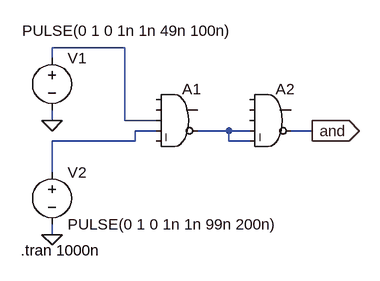
[diagram p0: schematic and_using_NAND.asc]
and_using_NAND.asc, the LTspice schematic file:
Version 4
SHEET 1 880 680
WIRE 128 16 16 16
WIRE 16 32 16 16
WIRE 16 128 16 112
WIRE 128 128 128 16
WIRE 176 128 128 128
WIRE 176 144 144 144
WIRE 288 144 240 144
WIRE 320 144 288 144
WIRE 416 144 384 144
WIRE 144 160 144 144
WIRE 144 160 16 160
WIRE 288 160 288 144
WIRE 320 160 288 160
WIRE 16 208 16 160
WIRE 16 304 16 288
FLAG 16 128 0
FLAG 16 304 0
FLAG 416 144 and
IOPIN 416 144 Out
SYMBOL voltage 16 16 R0
WINDOW 3 -46 -26 Left 2
WINDOW 123 0 0 Left 0
WINDOW 39 0 0 Left 0
SYMATTR Value PULSE(0 1 0 1n 1n 49n 100n)
SYMATTR InstName V1
SYMBOL Digital\\and 208 64 R0
SYMATTR InstName A1
SYMBOL Digital\\and 352 64 R0
SYMATTR InstName A2
SYMBOL voltage 16 192 R0
WINDOW 123 0 0 Left 0
WINDOW 39 0 0 Left 0
SYMATTR InstName V2
SYMATTR Value PULSE(0 1 0 1n 1n 99n 200n)
TEXT -32 328 Left 2 !.tran 1000n

The netlist it stands for:
* and_using_NAND.asc
V1 N001 0 PULSE(0 1 0 1n 1n 49n 100n)
A1 0 0 N001 N002 0 N003 0 0 AND
A2 0 0 0 N003 N003 and 0 0 AND
V2 N002 0 PULSE(0 1 0 1n 1n 99n 200n)
.tran 1000n
.backanno
.end